# EAGLE design BSPD_rev11_v2 (EAGLE 9.6.2)
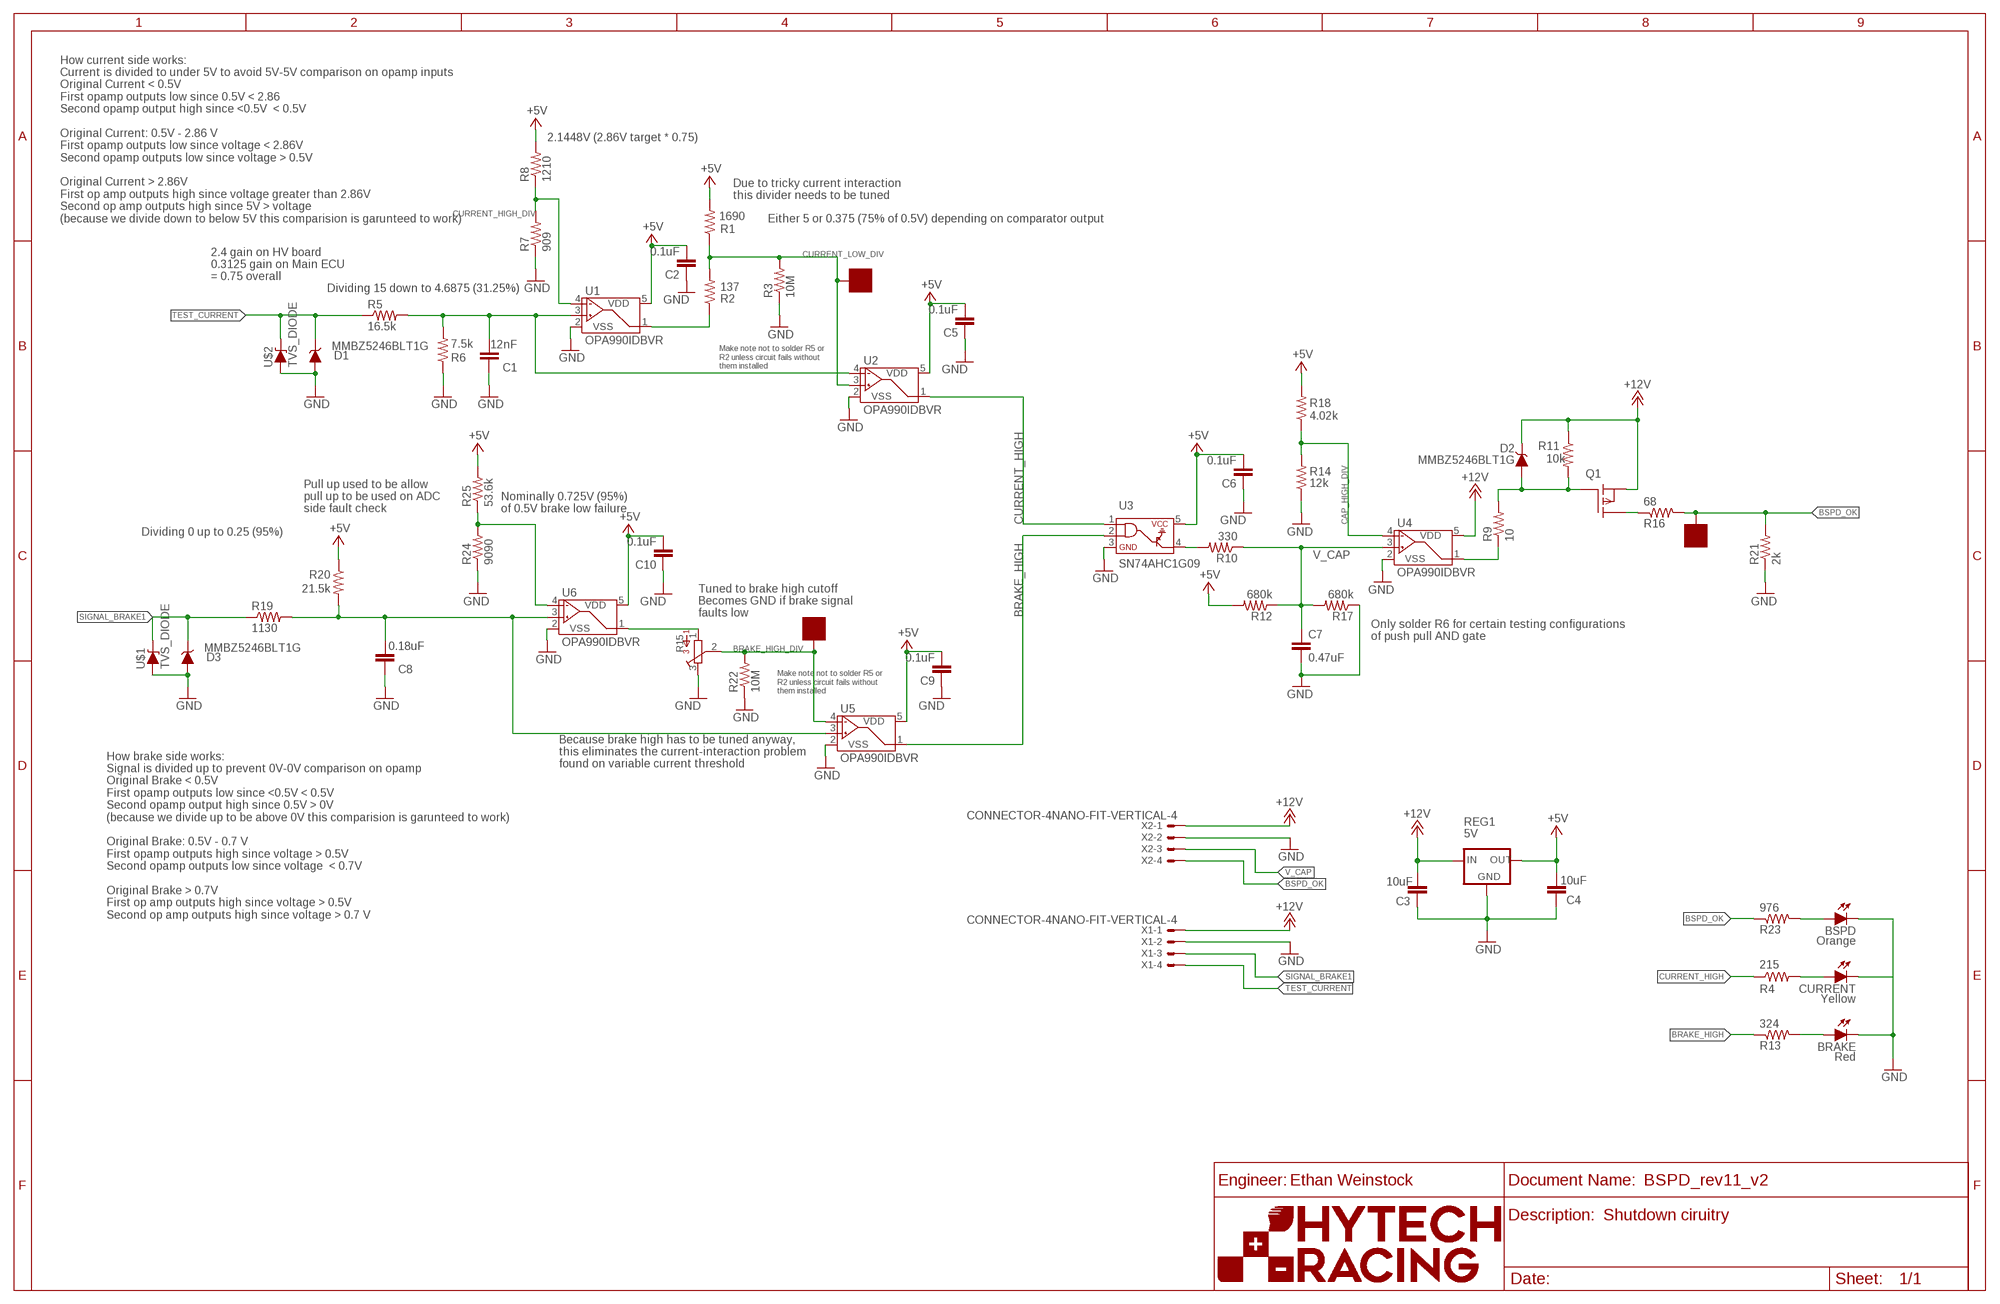
[diagram p0: schematic, sheet 1]
U202 (FRAME_B_L): ORIENTATION: LANDSCAPE; SIZE: B

## Parts
BRAKE  Red  LED-0603  [LED-603]
BRAKE_LOW_DIV  SOLDER_PAD  [SOLDER_PAD_XSMALL]
BSPD  Orange  LED-0603  [LED-603]
BSPD_OK  SOLDER_PAD  [SOLDER_PAD_XSMALL]
C1  12nF  CAP0603-CAP  [0603-CAP]
C2  0.1uF  CAP0603-CAP  [0603-CAP]
C3  10uF  CAP0603-CAP  [0603-CAP]
C4  10uF  CAP0603-CAP  [0603-CAP]
C5  0.1uF  CAP0603-CAP  [0603-CAP]
C6  0.1uF  CAP0603-CAP  [0603-CAP]
C7  0.47uF  CAP0603-CAP  [0603-CAP]
C8  0.18uF  CAP0603-CAP  [0603-CAP]
C9  0.1uF  CAP0603-CAP  [0603-CAP]
C10  0.1uF  CAP0603-CAP  [0603-CAP]
CURRENT  Yellow  LED-0603  [LED-603]
CURRENT_LOW_DIV  SOLDER_PAD  [SOLDER_PAD_XSMALL]
D1  MMBZ5246BLT1G  DIODE_ZENER  [SOT23]
D2  MMBZ5246BLT1G  DIODE_ZENER  [SOT23]
D3  MMBZ5246BLT1G  DIODE_ZENER  [SOT23]
Q1  P-CHANNEL_MOSFET_DMP3099L-7  [SOT23]
R1  1690  RESISTOR0603  [0603-RES]
R2  137  RESISTOR0603  [0603-RES]
R3  10M  RESISTOR0603  [0603-RES]
R4  215  RESISTOR0603  [0603-RES]
R5  16.5k  RESISTOR0603  [0603-RES]
R6  7.5k  RESISTOR0603  [0603-RES]
R7  909  RESISTOR0603  [0603-RES]
R8  1210  RESISTOR0603  [0603-RES]
R9  10  RESISTOR0603  [0603-RES]
R10  330  RESISTOR0603  [0603-RES]
R11  10k  RESISTOR0603  [0603-RES]
R12  680k  RESISTOR0603  [0603-RES]
R13  324  RESISTOR0603  [0603-RES]
R14  12k  RESISTOR0603  [0603-RES]
R15  TRIMPOT_3296C  [TRIMPOT_3296]
R16  68  RESISTOR0603  [0603-RES]
R17  680k  RESISTOR0603  [0603-RES]
R18  4.02k  RESISTOR0603  [0603-RES]
R19  1130  RESISTOR0603  [0603-RES]
R20  21.5k  RESISTOR0603  [0603-RES]
R21  2k  RESISTOR0603  [0603-RES]
R22  10M  RESISTOR0603  [0603-RES]
R23  976  RESISTOR0603  [0603-RES]
R24  9090  RESISTOR0603  [0603-RES]
R25  53.6k  RESISTOR0603  [0603-RES]
REG1  5V  OKI-78SR-5  [OKI-78SR]
U1  OPA990IDBVR  [SOT-23-5]
U2  OPA990IDBVR  [SOT-23-5]
U3  SN74AHC1G09  [SOT-23-5]
U4  OPA990IDBVR  [SOT-23-5]
U5  OPA990IDBVR  [SOT-23-5]
U6  OPA990IDBVR  [SOT-23-5]
U$1  TVS_DIODE  [U-DFN1608-2]
U$2  TVS_DIODE  [U-DFN1608-2]
X1  CONNECTOR-4NANO-FIT-VERTICAL-4  [NANO-FIT_VERTICAL-4]
X2  CONNECTOR-4NANO-FIT-VERTICAL-4  [NANO-FIT_VERTICAL-4]

## Nets
+5V: C2.2 C4.2 C5.2 C6.2 C9.2 C10.2 R1.2 R8.2 R12.2 R18.2 R20.1 R25.2 REG1.3(OUT) U1.5(VDD) U2.5(VDD) U3.5 U5.5(VDD) U6.5(VDD)
+12V: C3.2 D2.3(C) Q1.2(S) R11.1 REG1.1(IN) U4.5(VDD) X1.P$1 X2.P$1
BRAKE_HIGH: R13.1 U3.2 U5.1(VOUT)
BRAKE_HIGH_DIV: BRAKE_LOW_DIV.P$1 R15.2 R22.2 U5.4(VIN-)
BSPD_OK: BSPD_OK.P$1 R16.2 R21.2 R23.1 X2.P$4
CAP_HIGH_DIV: R14.2 R18.1 U4.4(VIN-)
CURRENT_HIGH: R4.1 U2.1(VOUT) U3.1
CURRENT_HIGH_DIV: R7.2 R8.1 U1.4(VIN-)
CURRENT_LOW_DIV: CURRENT_LOW_DIV.P$1 R1.1 R2.2 R3.2 U2.3(VIN+)
GND: BRAKE.C BSPD.C C1.1 C2.1 C3.1 C4.1 C5.1 C6.1 C7.2 C8.1 C9.1 C10.1 CURRENT.C D1.1(A) D3.1(A) R3.1 R6.1 R7.1 R14.1 R15.3 R17.1 R21.1 R22.1 R24.1 REG1.2(GND) U1.2(VSS) U2.2(VSS) U3.3 U4.2(VSS) U5.2(VSS) U6.2(VSS) U$1.P$1(A) U$2.P$1(A) X1.P$2 X2.P$2
N$1: Q1.3(D) R16.1
N$3: R15.1 U6.1(VOUT)
N$4: R9.1 U4.1(VOUT)
N$5: C8.2 R19.2 R20.2 U5.3(VIN+) U6.3(VIN+)
N$15: R24.2 R25.1 U6.4(VIN-)
N$19: R2.1 U1.1(VOUT)
N$102: CURRENT.A R4.2
N$103: BRAKE.A R13.2
N$106: C1.2 R5.2 R6.2 U1.3(VIN+) U2.4(VIN-)
N$107: R10.2 U3.4
N$108: BSPD.A R23.2
N$112: D2.1(A) Q1.1(G) R9.2 R11.2
SIGNAL_BRAKE1: D3.3(C) R19.1 U$1.P$2(C) X1.P$3
TEST_CURRENT: D1.3(C) R5.1 U$2.P$2(C) X1.P$4
V_CAP: C7.1 R10.1 R12.1 R17.2 U4.3(VIN+) X2.P$3

## Notes on the sheet
- 2.1448V (2.86V target * 0.75)
- Due to tricky current interaction
  this divider needs to be tuned
- How current side works:
  Current is divided to under 5V to avoid 5V-5V comparison on opamp inputs
  Original Current < 0.5V
  First opamp outputs low since 0.5V < 2.86
  Second opamp output high since <0.5V  < 0.5V
  
  Original Current: 0.5V - 2.86 V
  First opamp outputs low since voltage < 2.86V
  Second opamp outputs low since voltage > 0.5V
  
  Original Current > 2.86V
  First op amp outputs high since voltage greater than 2.86V
  Second op amp outputs high since 5V > voltage
  (because we divide down to below 5V this comparision is garunteed to work)
- Either 5 or 0.375 (75% of 0.5V) depending on comparator output
- 2.4 gain on HV board
  0.3125 gain on Main ECU
  = 0.75 overall
- Dividing 15 down to 4.6875 (31.25%)
- Make note not to solder R5 or 
  R2 unless circuit fails without
  them installed
- Pull up used to be allow
  pull up to be used on ADC
  side fault check
- Nominally 0.725V (95%)
  of 0.5V brake low failure
- Dividing 0 up to 0.25 (95%)
- Tuned to brake high cutoff
  Becomes GND if brake signal
  faults low
- Only solder R6 for certain testing configurations
  of push pull AND gate
- Make note not to solder R5 or 
  R2 unless circuit fails without
  them installed
- Because brake high has to be tuned anyway,
  this eliminates the current-interaction problem
  found on variable current threshold
- How brake side works:
  Signal is divided up to prevent 0V-0V comparison on opamp
  Original Brake < 0.5V
  First opamp outputs low since <0.5V < 0.5V
  Second opamp output high since 0.5V > 0V
  (because we divide up to be above 0V this comparision is garunteed to work)
  
  Original Brake: 0.5V - 0.7 V
  First opamp outputs high since voltage > 0.5V
  Second opamp outputs low since voltage  < 0.7V
  
  Original Brake > 0.7V
  First op amp outputs high since voltage > 0.5V
  Second op amp outputs high since voltage > 0.7 V
- Ethan Weinstock
- Shutdown ciruitry

## Library data of the parts
BRAKE BSPD CURRENT = HyTechDevices:LED: Light Emitting Diode (LED) Source: Dangerous Prototypes Eagle Library <https://github.com/DangerousPrototypes/Eagle_Part_Library>
BRAKE_LOW_DIV BSPD_OK CURRENT_LOW_DIV = HyTechDevices:SOLDER_PAD: Solder pad used to attach wires directly to PCB
C1-C10 = HyTechDevices:CAP: Capacitor Standard 0603 ceramic capacitor, and 0.1" leaded capacitor.
D1-D3 = HyTechDevices:DIODE_ZENER: ZENER DIODE
Q1 = HyTechDevices:P-CHANNEL_MOSFET_DMP3099L-7: Diodes Incorporated P-Channel Enhancement Mode MOSFET Datasheet <http://www.mouser.com/ds/2/115/DMP3099L-266220.pdf>
R1-R14 R16-R25 = HyTechDevices:RESISTOR: Resistor Basic schematic elements and footprints for 0603, 1206, and PTH resistors.
R15 = HyTechDevices:TRIMPOT_3296: 3296 Series 3/8" Square Trimmer Source <https://github.com/chiengineer/Eagle-Libraries/blob/master/Potentiometers/bourns.lbr>
REG1 = HyTechDevices:OKI-78SR-5: Murata OKI-78SR 5V 1.5A Non-Isolated Switching Regulator DC/DC - Datasheet <https://power.murata.com/data/power/oki-78sr.pdf>
U1 U2 U4-U6 = HyTechDevices:OPA990IDBVR: TI OPA990 20V Op-Amp Comparator Datasheet <https://www.ti.com/lit/ds/symlink/opa990.pdf>
U3 = HyTechDevices:SN74AHC1G09: TI SN74AHC1G09 Single 2–Input Positive-AND Gate With Open-Drain Output Datasheet <http://www.ti.com/lit/ds/symlink/sn74ahc1g09.pdf>
U$1 U$2 = HyTechDevices:TVS_DIODE
X1 X2 = HyTechDevices:CONNECTOR-4: Mini-Fit Junior connector 4 pole Source: http://www.molex.com

## Board
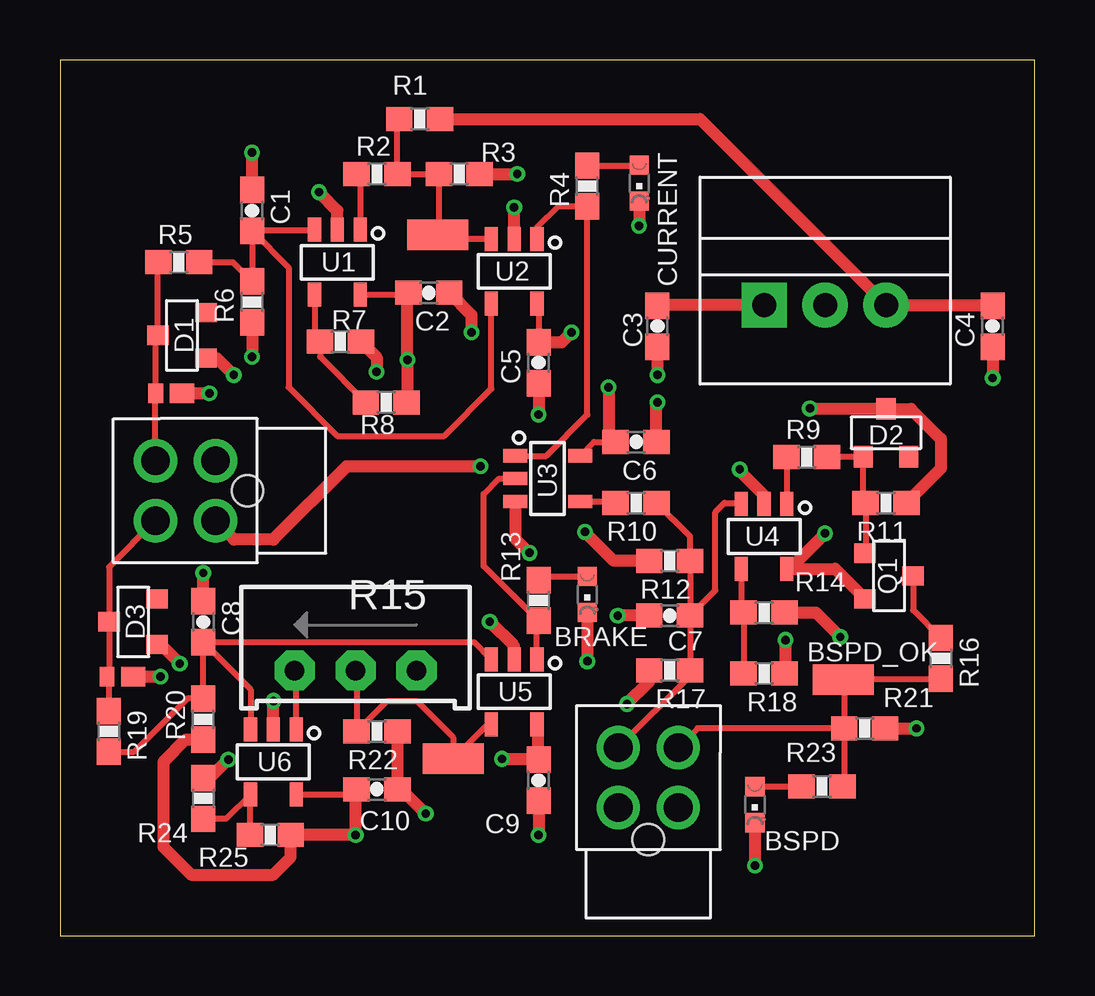
[diagram p1: board, top side]
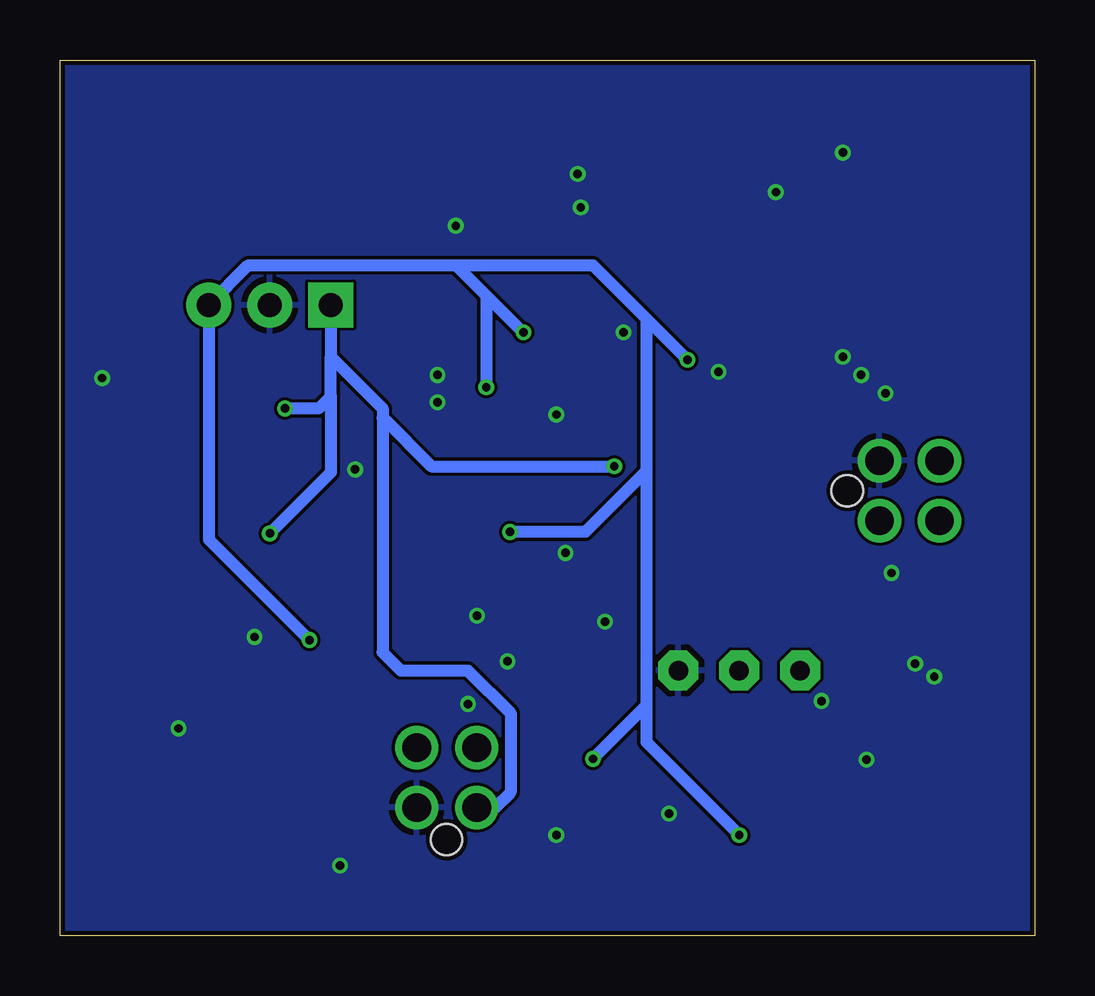
[diagram p2: board, bottom side, seen from below]

Size 40.62 x 36.5 mm. Coordinates in mm from the lower left corner, seen from the top.
Outline: 0,0 40.62,0 40.62,36.5 0,36.5 0,0
Copper layers (1*16): Top 0.035mm / dielectric 1.53mm / Bottom 0.035mm
Design rules "JLCPCB (2 Layer)": minimum track width 5mil, minimum drill 0.3mm, track to track 5mil, track to pad 5mil, pad to pad 5mil, via to via 20mil, smd to smd 5mil, copper to edge 0.2mm, drill to drill 21mil, minimum pad ring 6mil, minimum via ring 6mil, stop-mask expansion 6mil, vias tented up to drill 30mil, thermal gap 10mil

### Footprints (pad centres in the part's own frame; a part is rotated, then mirrored left to right if it is on the bottom)
LED-603 = smd 0.8 x 0.8: A 0,-0.75; C 0,0.75
SOLDER_PAD_XSMALL = smd 2.54 x 1.27: P$1 0,0
0603-CAP = smd 1.1 x 1: 1 -0.85,0; 2 0.85,0
SOT23 = smd 0.8 x 0.9: 1 -0.95,-1; 2 0.95,-1; 3 0,1
0603-RES = smd 1.1 x 1: 1 -0.85,0; 2 0.85,0
TRIMPOT_3296 = drill 0.813 pad 1.676 octagon: 1 2.54,1.27; 2 0,1.27; 3 -2.54,1.27
OKI-78SR = drill 1 pad 1.88 square: 1 -2.54,0 | drill 1 pad 1.88: 2 0,0; 3 2.54,0
SOT-23-5 = smd 1 x 0.55: 1 -1.35,0.95; 2 -1.35,0; 3 -1.35,-0.95; 4 1.35,-0.95; 5 1.35,0.95
U-DFN1608-2 = smd 0.8 x 1.011: P$1 0,0 | smd 0.8 x 0.61: P$2 0,-1.092
NANO-FIT_VERTICAL-4 = drill 1.2: P$1 -1.25,0; P$2 1.25,0; P$3 -1.25,2.5; P$4 1.25,2.5 | hole 1.3: 0,-1.34

### Placement (x,y rotation side)
BRAKE  21.97,14.22 180 top
BRAKE_LOW_DIV  16.38,7.37 0 top
BSPD  28.96,5.46 180 top
BSPD_OK  32.64,10.67 0 top
C1  8,30.23 270 top
C2  15.37,26.8 180 top
C3  24.89,25.4 90 top
C4  38.86,25.4 90 top
C5  19.94,23.88 90 top
C6  24,20.57 180 top
C7  25.4,13.34 180 top
C8  5.97,13.08 270 top
C9  19.94,6.48 90 top
C10  13.21,6.1 180 top
CURRENT  24.13,31.37 180 top
CURRENT_LOW_DIV  15.75,29.21 0 top
D1  5.08,25.02 90 top
D2  34.42,20.95 0 top
D3  3.05,13.08 90 top
Q1  34.54,14.99 270 top
R1  14.99,34.04 0 top
R2  13.21,31.75 0 top
R3  16.64,31.75 180 top
R4  21.97,31.24 90 top
R5  4.95,28.07 0 top
R6  8,26.42 90 top
R7  11.68,24.77 180 top
R8  13.59,22.23 0 top
R9  31.11,19.94 0 top
R10  24,18.03 180 top
R11  34.42,18.03 180 top
R12  25.4,15.62 180 top
R13  19.94,13.97 90 top
R14  29.34,13.46 180 top
R15  12.32,12.32 180 top
R16  36.7,11.56 270 top
R17  25.4,11.05 0 top
R18  29.34,10.92 0 top
R19  2.03,8.51 270 top
R20  5.97,9.02 90 top
R21  33.53,8.64 180 top
R22  13.21,8.51 180 top
R23  31.75,6.22 180 top
R24  5.97,5.71 270 top
R25  8.76,4.19 0 top
REG1  31.88,26.29 0 top
U1  11.56,28.07 270 top
U2  18.92,27.69 270 top
U3  20.32,19.05 0 top
U4  29.34,16.64 270 top
U5  18.92,10.16 270 top
U6  8.89,7.24 270 top
U$1  3.05,10.79 270 top
U$2  5.08,22.61 270 top
X1  6.48,18.54 90 top
X2  24.51,5.33 0 top

### Tracks (layer width: path | path; a pad name or v marks a point on that pad's centre or on a via)
+5V  (via drill 0.35)
  Top 0.254: U3.5 22.24,20.57 C6.2 | U6.5 12.15,5.89 12.32,6.06 | U2.5 19.94,26.27 C5.2 | U1.5 14.44,26.72 C2.2
  Top 0.508: C4.2 38.82,26.29 REG1.3 26.67,34.04 R1.2 | v21.31,25.15 20.89,24.73 C5.2 | v22.86,22.86 22.86,20.87 C6.2 | C2.2 14.48,26.76 v14.48,24 14.48,22.26 R8.2 | R12.2 23.07,15.62 v21.87,16.83 | C10.2 12.32,6.06 v12.32,4.19 R25.2 9.61,3.26 8.89,2.54 5.46,2.54 4.32,3.68 4.32,7.24 5.25,8.17 R20.1 | v30.23,12.32 30.23,10.96 R18.2 | v18.41,7.37 19.9,7.37 | 19.9,7.37 C9.2 | U5.5 19.9,8.78 19.9,7.37
  Bottom 0.508: 24.13,27.94 32.77,27.94 REG1.3 34.42,16.51 v30.23,12.32 | 24.13,27.94 18.41,27.94 16.19,25.72 | 16.19,25.72 v14.48,24 | 24.13,27.94 22.86,26.67 | 22.86,26.67 21.34,25.15 v21.31,25.15 | 22.86,26.67 v22.86,22.86 | v21.87,16.83 18.73,16.83 16.19,19.37 | 16.19,25.72 16.19,19.37 | 16.19,19.37 16.19,9.59 | 16.19,9.59 v18.41,7.37 | 16.19,9.59 16.19,8.06 v12.32,4.19
+12V  (via drill 0.35)
  Top 0.508: REG1.1 24.93,26.29 C3.2 | v31.24,21.97 34.4,21.97 D2.3 35.45,21.95 36.7,20.7 36.7,19.47 R11.1 | v31.88,16.76 30.4,15.29 U4.5 32.29,15.29 Q1.2 | v17.53,19.56 11.94,19.56 8.89,16.51 7.26,16.51 X1.P$1
  Bottom 0.508: REG1.1 29.34,24.13 | 29.34,22.48 29.34,24.13 | 29.34,22.48 29.84,21.97 v31.24,21.97 | 29.34,22.48 29.34,19.3 v31.88,16.76 | 29.34,24.13 27.18,21.97 27.18,21.59 | 27.18,21.59 27.18,11.81 26.42,11.05 23.62,11.05 21.84,9.27 21.84,5.97 22.48,5.33 X2.P$1 | 27.18,21.59 25.15,19.56 v17.53,19.56
BRAKE_HIGH
  Top 0.152: 19.92,13.1 R13.1
  Top 0.254: R13.1 17.65,15.41 17.65,18.41 18.29,19.05 U3.2 | U5.1 19.87,13.05 19.92,13.1
BRAKE_HIGH_DIV
  Top 0.254: R15.2 12.36,11.01 R22.2 13.63,9.78 14.86,9.78 16.38,8.26 BRAKE_LOW_DIV.P$1 17.83,8.81 U5.4
BSPD_OK
  Top 0.152: 32.68,6.3 R23.1
  Top 0.254: R16.2 36.66,10.67 BSPD_OK.P$1 32.68,10.63 R21.2 | R21.2 32.68,6.3 | R21.2 26.56,8.64 X2.P$4
CAP_HIGH_DIV
  Top 0.254: U4.4 28.39,13.56 R14.2 R18.1
CURRENT_HIGH
  Top 0.254: U3.1 20.25,20 21.97,21.72 R4.1 20.74,30.39 19.87,29.52 U2.1
CURRENT_HIGH_DIV
  Top 0.254: U1.4 10.61,24.99 R7.2 10.83,24.13 R8.1
CURRENT_LOW_DIV
  Top 0.254: U2.3 15.92,29.04 CURRENT_LOW_DIV.P$1 15.79,29.25 R3.2 R2.2 14.06,33.96 R1.1
GND  (via drill 0.35)
  Top 0.508: R3.1 v19.05,31.75 | U2.2 v18.92,30.35 | C1.1 v8,32.64 | R6.1 v8,24.13 | U1.2 11.56,30.23 v10.79,30.99 | U$2.P$1 v6.22,22.61 | D1.1 6.54,24.07 v7.24,23.37 | R7.1 13.19,24.11 v13.19,23.5 | C2.1 17.14,25.87 v17.14,25.15 | CURRENT.C v24.13,29.59 | C5.1 v19.94,21.72 | C3.1 v24.89,23.37 | U4.2 29.34,18.35 28.32,19.37 v28.32,19.43 | R14.1 31.5,13.46 v32.51,12.45 | R21.1 v35.69,8.64 | BSPD.C v28.96,2.92 | C9.1 v19.94,4.19 | U3.3 18.97,16.54 v19.56,15.95 | BRAKE.C v21.97,11.43 | C7.2 v23.24,13.34 | R17.1 24.55,10.58 v23.62,9.65 | U5.2 18.92,12.06 v17.91,13.08 | v15.24,5.08 14.22,6.1 C10.1 R22.1 | C6.1 24.85,22.19 v24.89,22.23 | C4.1 v38.86,23.24 | U6.2 v8.89,9.78 | R24.1 6.24,6.57 v7.01,7.34 | U$1.P$1 v4.19,10.79 | D3.1 4.2,12.13 v4.99,11.34 | C8.1 v5.97,15.11
  pour Bottom: -1.27,37.72 41.91,37.72 41.91,-1.27 -1.27,-1.27
N$1
  Top 0.254: Q1.3 35.54,13.57 R16.1
N$3
  Top 0.254: U6.1 9.84,10.99 R15.1
N$4
  Top 0.254: R9.1 30.29,19.92 U4.1
N$5
  Top 0.254: C8.2 R20.2 5.93,9.91 5.33,9.91 3.09,7.66 R19.2 | C8.2 7.94,10.26 U6.3 | C8.2 17.25,12.23 U5.3
N$15
  Top 0.254: R25.1 7.91,5.86 U6.4 6.92,4.87 R24.2
N$19
  Top 0.254: R2.1 12.51,31.6 U1.1
N$102
  Top 0.254: R4.2 24.1,32.09 CURRENT.A
N$103
  Top 0.254: R13.2 20.09,14.97 BRAKE.A
N$106
  Top 0.254: U1.3 10.57,29.38 C1.2 | C1.2 9.53,27.85 9.53,22.86 11.56,20.83 16,20.83 17.97,22.8 U2.4 | C1.2 R6.2 7.2,28.07 R5.2
N$107
  Top 0.254: U3.4 23.09,18.1 R10.2
N$108
  Top 0.254: BSPD.A 28.97,6.22 R23.2
N$112
  Top 0.152: 31.98,19.95 R9.2
  Top 0.254: 31.98,19.95 D2.1 33.47,18.13 R11.2 33.57,15.96 Q1.1
SIGNAL_BRAKE1
  Top 0.254: X1.P$3 2.05,15.36 D3.3 2.05,10.89 U$1.P$2 2.03,10.72 R19.1
TEST_CURRENT
  Top 0.254: X1.P$4 3.98,22.59 U$2.P$2 3.99,24.93 D1.3 4.08,28.04 R5.1
V_CAP
  Top 0.152: 28.34,18.03 U4.3
  Top 0.254: R10.1 26.25,16.64 R12.1 C7.1 | C7.1 27.3,14.39 27.3,17.65 27.69,18.03 28.34,18.03 | C7.1 R17.2 26.25,10.82 X2.P$3

### Text on the board
tDocu: CLD | BHD | BSPD_rev11_v2 / Designed by Jeffrey Shao